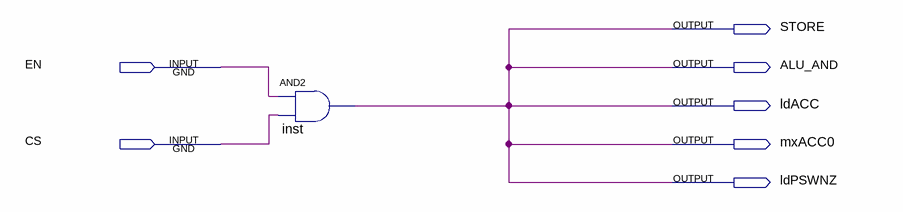
[diagram p0: schematic sheet]
// Quartus schematic AND_.bdf as structural Verilog: 1 symbols, 7 pins
module AND_ (
  input  EN,
  input  CS,
  output STORE,
  output ALU_AND,
  output ldACC,
  output mxACC0,
  output ldPSWNZ
);

  and inst (ALU_AND, EN, CS);

  assign ldACC = ALU_AND;
  assign ldPSWNZ = ALU_AND;
  assign mxACC0 = ALU_AND;
  assign STORE = ALU_AND;
endmodule
